# EAGLE design esp32_plus (EAGLE 9.6.2)
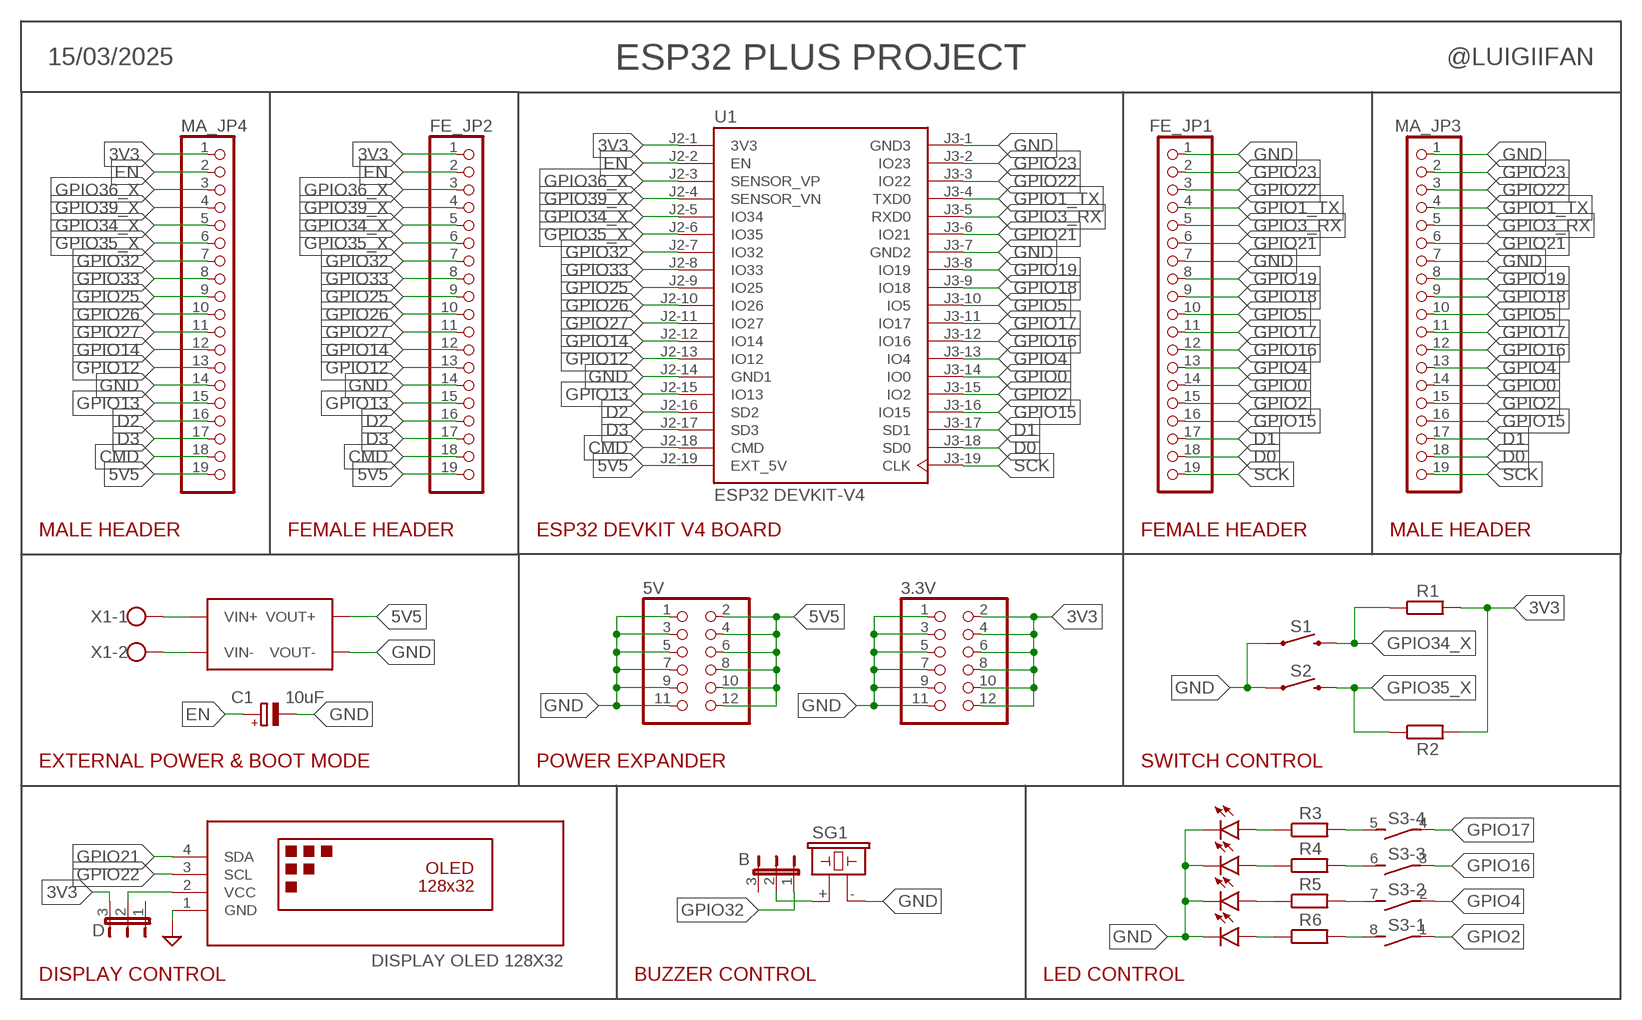
[diagram p0: schematic, sheet 1]

## Parts
3.3V  PINHD-2X6  [2X06]
5V  PINHD-2X6  [2X06]
B  JP2E  [JP2]
C1  10uF  CPOL-EUE2.5-5  [E2,5-5]
D  JP2E  [JP2]
FE_JP1  PINHD-1X19  [1X19]
FE_JP2  PINHD-1X19  [1X19]
L1  LED3MM  [LED3MM]
L2  LED3MM  [LED3MM]
L3  LED3MM  [LED3MM]
L4  LED3MM  [LED3MM]
MA_JP3  PINHD-1X19  [1X19]
MA_JP4  PINHD-1X19  [1X19]
MP1584  MP1584  [DC-BRICK]
R1  R-EU_0207/10  [0207/10]
R2  R-EU_0207/10  [0207/10]
R3  R-EU_0207/10  [0207/10]
R4  R-EU_0207/10  [0207/10]
R5  R-EU_0207/10  [0207/10]
R6  R-EU_0207/10  [0207/10]
S1  MOMENTARY-SWITCH-SPST-PTH-6.0MM  [TACTILE_SWITCH_PTH_6.0MM]
S2  MOMENTARY-SWITCH-SPST-PTH-6.0MM  [TACTILE_SWITCH_PTH_6.0MM]
S3  DS04E  [DS-04]
SG1  F/CM12P  [F/CM12P]
U1  ESP32 DEVKIT-V4  ESP32-DEVKITC-32D  [MODULE_ESP32-DEVKITC-32D]
U$1  DISPLAY OLED 128X32  DISPLAY-OLED-128X32  [DISPLAY-OLED-128X32]
X1  W237-102  [W237-102]

## Nets
3V3: 3.3V.2 3.3V.4 3.3V.6 3.3V.8 3.3V.10 3.3V.12 D.3 FE_JP2.1 MA_JP4.1 R1.2 R2.2 U1.J2-1(3V3)
5V5: 5V.2 5V.4 5V.6 5V.8 5V.10 5V.12 FE_JP2.19 MA_JP4.19 MP1584.OUT1+(VOUT+) MP1584.OUT2+(VOUT+) U1.J2-19(EXT_5V)
CMD: FE_JP2.18 MA_JP4.18 U1.J2-18(CMD)
D0: FE_JP1.18 MA_JP3.18 U1.J3-18(SD0)
D1: FE_JP1.17 MA_JP3.17 U1.J3-17(SD1)
D2: FE_JP2.16 MA_JP4.16 U1.J2-16(SD2)
D3: FE_JP2.17 MA_JP4.17 U1.J2-17(SD3)
EN: C1.+ FE_JP2.2 MA_JP4.2 U1.J2-2(EN)
GND: 3.3V.1 3.3V.3 3.3V.5 3.3V.7 3.3V.9 3.3V.11 5V.1 5V.3 5V.5 5V.7 5V.9 5V.11 C1.- FE_JP1.1 FE_JP1.7 FE_JP2.14 L1.K(C) L2.K(C) L3.K(C) L4.K(C) MA_JP3.1 MA_JP3.7 MA_JP4.14 MP1584.OUT1-(VOUT-) MP1584.OUT2-(VOUT-) S1.1 S2.1 SG1.- U1.J2-14(GND1) U1.J3-1(GND3) U1.J3-7(GND2) U$1.1(GND)
GPIO0: FE_JP1.14 MA_JP3.14 U1.J3-14(IO0)
GPIO1_TX: FE_JP1.4 MA_JP3.4 U1.J3-4(TXD0)
GPIO2: FE_JP1.15 MA_JP3.15 S3.1 U1.J3-15(IO2)
GPIO3_RX: FE_JP1.5 MA_JP3.5 U1.J3-5(RXD0)
GPIO4: FE_JP1.13 MA_JP3.13 S3.2 U1.J3-13(IO4)
GPIO5: FE_JP1.10 MA_JP3.10 U1.J3-10(IO5)
GPIO12: FE_JP2.13 MA_JP4.13 U1.J2-13(IO12)
GPIO13: FE_JP2.15 MA_JP4.15 U1.J2-15(IO13)
GPIO14: FE_JP2.12 MA_JP4.12 U1.J2-12(IO14)
GPIO15: FE_JP1.16 MA_JP3.16 U1.J3-16(IO15)
GPIO16: FE_JP1.12 MA_JP3.12 S3.3 U1.J3-12(IO16)
GPIO17: FE_JP1.11 MA_JP3.11 S3.4 U1.J3-11(IO17)
GPIO18: FE_JP1.9 MA_JP3.9 U1.J3-9(IO18)
GPIO19: FE_JP1.8 MA_JP3.8 U1.J3-8(IO19)
GPIO21: FE_JP1.6 MA_JP3.6 U1.J3-6(IO21) U$1.4(SDA)
GPIO22: FE_JP1.3 MA_JP3.3 U1.J3-3(IO22) U$1.3(SCL)
GPIO23: FE_JP1.2 MA_JP3.2 U1.J3-2(IO23)
GPIO25: FE_JP2.9 MA_JP4.9 U1.J2-9(IO25)
GPIO26: FE_JP2.10 MA_JP4.10 U1.J2-10(IO26)
GPIO27: FE_JP2.11 MA_JP4.11 U1.J2-11(IO27)
GPIO32: B.1 FE_JP2.7 MA_JP4.7 U1.J2-7(IO32)
GPIO33: FE_JP2.8 MA_JP4.8 U1.J2-8(IO33)
GPIO34_X: FE_JP2.5 MA_JP4.5 R1.1 S1.4 U1.J2-5(IO34)
GPIO35_X: FE_JP2.6 MA_JP4.6 R2.1 S2.4 U1.J2-6(IO35)
GPIO36_X: FE_JP2.3 MA_JP4.3 U1.J2-3(SENSOR_VP)
GPIO39_X: FE_JP2.4 MA_JP4.4 U1.J2-4(SENSOR_VN)
N$1: D.2 U$1.2(VCC)
N$2: R4.2 S3.6
N$3: R5.2 S3.7
N$4: R6.2 S3.8
N$5: R3.2 S3.5
N$6: B.2 SG1.+
N$17: L1.A R3.1
N$18: L2.A R4.1
N$19: L3.A R5.1
N$20: L4.A R6.1
N$21: MP1584.IN1+(VIN+) MP1584.IN2+(VIN+) X1.1
N$23: MP1584.IN1-(VIN-) MP1584.IN2-(VIN-) X1.2
SCK: FE_JP1.19 MA_JP3.19 U1.J3-19(CLK)
Unconnected: B.3 D.1

## Notes on the sheet
- ESP32 PLUS PROJECT
- 15/03/2025 | @LUIGIIFAN
- MALE HEADER | FEMALE HEADER | ESP32 DEVKIT V4 BOARD | FEMALE HEADER | MALE HEADER
- EXTERNAL POWER & BOOT MODE | POWER EXPANDER | SWITCH CONTROL
- DISPLAY CONTROL | BUZZER CONTROL | LED CONTROL

## Library data of the parts
3.3V 5V = pinhead_Edit:PINHD-2X6: PIN HEADER
B D = jumper_edit:JP2E: JUMPER
C1 = rcl_Edit:CPOL-EU: POLARIZED CAPACITOR, European symbol; SPICEPREFIX: C
FE_JP1 FE_JP2 MA_JP3 MA_JP4 = pinhead_Edit:PINHD-1X19: PIN HEADER
L1 = led_Edit:LED: LED OSRAM: - CHIPLED LG R971, LG N971, LY N971, LG Q971, LY Q971, LO R971, LY R971 LH N974, LH R974 LS Q976, LO Q976, LY Q976 LO Q996 - Hyper CHIPLED LW Q18S LB Q993, LB Q99A, LB R99A - SideLED LS A670, LO A670, LY A670, LG A670, LP A670 LB A673, LV A673, LT A673, LW A673 LH A674 LY A675 LS A676, LA A676, LO A676, LY A676, LW A676 LS A679, LY A679, LG A679 - Hyper Micro SIDELED® LS Y876, LA Y876, LO Y876, LY Y876 LT Y87S - SmartLED LW L88C, LW L88S LB L89C, LB L89S, LG L890 LS L89K, LO L89K, LY L89K LS L896, LA L896, LO L896, LY L896 - TOPLED LS T670, LO T670, LY T670, LG T670, LP T670 LSG T670, LSP T670, LSY T670, LOP T670, LYG T670 LG T671, LOG T671, LSG T671 LB T673, LV T673, LT T673, LW T673 LH T674 LS T676, LA T676, LO T676, LY T676, LB T676, LH T676, LSB T676, LW T676 LB T67C, LV T67C, LT T67C, LS T67K, LO T67K, LY T67K, LW E67C LS E67B, LA E67B, LO E67B, LY E67B, LB E67C, LV E67C, LT E67C LW T67C LS T679, LY T679, LG T679 LS T770, LO T770, LY T770, LG T770, LP T770 LB T773, LV T773, LT T773, LW T773 LH T774 LS E675, LA E675, LY E675, LS T675 LS T776, LA T776, LO T776, LY T776, LB T776 LHGB T686 LT T68C, LB T68C - Hyper Mini TOPLED® LB M676 - Mini TOPLED Santana® LG M470 LS M47K, LO M47K, LY M47K Source: http://www.osram.convergy.de LUXEON: - LUMILED® LXK2-PW12-R00, LXK2-PW12-S00, LXK2-PW14-U00, LXK2-PW14-V00 LXK2-PM12-R00, LXK2-PM12-S00, LXK2-PM14-U00 LXK2-PE12-Q00, LXK2-PE12-R00, LXK2-PE12-S00, LXK2-PE14-T00, LXK2-PE14-U00 LXK2-PB12-K00, LXK2-PB12-L00, LXK2-PB12-M00, LXK2-PB14-N00, LXK2-PB14-P00, LXK2-PB14-Q00 LXK2-PR12-L00, LXK2-PR12-M00, LXK2-PR14-Q00, LXK2-PR14-R00 LXK2-PD12-Q00, LXK2-PD12-R00, LXK2-PD12-S00 LXK2-PH12-R00, LXK2-PH12-S00 LXK2-PL12-P00, LXK2-PL12-Q00, LXK2-PL12-R00 Source: www.luxeon.com KINGBRIGHT: KA-3528ASYC Source: www.kingbright.com; SPICEPREFIX: L
L2-L4 = led_Edit:LED: LED OSRAM: - CHIPLED LG R971, LG N971, LY N971, LG Q971, LY Q971, LO R971, LY R971 LH N974, LH R974 LS Q976, LO Q976, LY Q976 LO Q996 - Hyper CHIPLED LW Q18S LB Q993, LB Q99A, LB R99A - SideLED LS A670, LO A670, LY A670, LG A670, LP A670 LB A673, LV A673, LT A673, LW A673 LH A674 LY A675 LS A676, LA A676, LO A676, LY A676, LW A676 LS A679, LY A679, LG A679 - Hyper Micro SIDELED® LS Y876, LA Y876, LO Y876, LY Y876 LT Y87S - SmartLED LW L88C, LW L88S LB L89C, LB L89S, LG L890 LS L89K, LO L89K, LY L89K LS L896, LA L896, LO L896, LY L896 - TOPLED LS T670, LO T670, LY T670, LG T670, LP T670 LSG T670, LSP T670, LSY T670, LOP T670, LYG T670 LG T671, LOG T671, LSG T671 LB T673, LV T673, LT T673, LW T673 LH T674 LS T676, LA T676, LO T676, LY T676, LB T676, LH T676, LSB T676, LW T676 LB T67C, LV T67C, LT T67C, LS T67K, LO T67K, LY T67K, LW E67C LS E67B, LA E67B, LO E67B, LY E67B, LB E67C, LV E67C, LT E67C LW T67C LS T679, LY T679, LG T679 LS T770, LO T770, LY T770, LG T770, LP T770 LB T773, LV T773, LT T773, LW T773 LH T774 LS E675, LA E675, LY E675, LS T675 LS T776, LA T776, LO T776, LY T776, LB T776 LHGB T686 LT T68C, LB T68C - Hyper Mini TOPLED® LB M676 - Mini TOPLED Santana® LG M470 LS M47K, LO M47K, LY M47K Source: http://www.osram.convergy.de LUXEON: - LUMILED® LXK2-PW12-R00, LXK2-PW12-S00, LXK2-PW14-U00, LXK2-PW14-V00 LXK2-PM12-R00, LXK2-PM12-S00, LXK2-PM14-U00 LXK2-PE12-Q00, LXK2-PE12-R00, LXK2-PE12-S00, LXK2-PE14-T00, LXK2-PE14-U00 LXK2-PB12-K00, LXK2-PB12-L00, LXK2-PB12-M00, LXK2-PB14-N00, LXK2-PB14-P00, LXK2-PB14-Q00 LXK2-PR12-L00, LXK2-PR12-M00, LXK2-PR14-Q00, LXK2-PR14-R00 LXK2-PD12-Q00, LXK2-PD12-R00, LXK2-PD12-S00 LXK2-PH12-R00, LXK2-PH12-S00 LXK2-PL12-P00, LXK2-PL12-Q00, LXK2-PL12-R00 Source: www.luxeon.com KINGBRIGHT: KA-3528ASYC Source: www.kingbright.com
MP1584 = MP1584:MP1584: MP1584-dc-brick-pcb Step down Input: 4.5V - 28V Ouput 0.8V - 25V max. 3A Cheap on ebay
R1-R6 = rcl_Edit:R-EU_: RESISTOR, European symbol; SPICEPREFIX: R
S1 S2 = Sparkfun-SwitchEdit:MOMENTARY-SWITCH-SPST: Momentary Switch (Pushbutton) - SPST Normally-open (NO) SPST momentary switches (buttons, pushbuttons). Variants PTH-12MM - 12mm square, through-hole Momentary Pushbutton Switch - 12mm Square <https://www.sparkfun.com/products/9190> (COM-09190) PTH-6.0MM, PTH-6.0MM-KIT - 6.0mm square, through-hole Mini Pushbutton Switch <https://www.sparkfun.com/products/97> (COM-00097) KIT package intended for soldering kit's - only one side of pads' copper is exposed. PTH-RIGHT-ANGLE-KIT - Right-angle, through-hole Right Angle Tactile Button <https://www.sparkfun.com/products/10791> - Used on SparkFun BigTime Watch Kit <https://www.sparkfun.com/products/11734> SMD-12MM - 12mm square, surface-mount Tactile Button - SMD (12mm) <https://www.sparkfun.com/products/12993> (COM-12993) Used on SparkFun PicoBoard <https://www.sparkfun.com/products/11888> SMD-4.5MM - 4.5mm Square Trackball Switch Used on SparkFun Blackberry Trackballer Breakout <https://www.sparkfun.com/products/13169> SMD-4.6MMX2.8MM - 4.60mm x 2.80mm, surface mount Used on SparkFun SAMD21 Mini Breakout <https://www.sparkfun.com/products/13664> SMD-5.2MM, SMD-5.2-REDUNDANT - 5.2mm square, surface-mount Mini Pushbutton Switch - SMD <https://www.sparkfun.com/products/8720> (COM-08720) Used on Arduino Pro Mini <https://www.sparkfun.com/products/11114> REDUNDANT package connects both switch circuits together SMD-6.0X3.5MM - 6.0 x 3.5mm, surface mount Momentary Reset Switch SMD <https://www.sparkfun.com/products/8229> (COM-08229) SMD-6.2MM-TALL - 6.2mm square, surface mount Tactile Button - SMD (6mm) <https://www.sparkfun.com/products/12992> Used on SparkFun Digital Sandbox <https://www.sparkfun.com/products/12651> SMD-RIGHT-ANGLE - Right-angle, surface mount Used on SparkFun Block for Intel® Edison - Arduino <https://www.sparkfun.com/products/13036>; PROD_ID: SWCH-08441; SF_SKU: COM-00097
S3 = switch-dil:DS04E: DIL/CODE SWITCH; OC_FARNELL: unknown; OC_NEWARK: unknown
SG1 = buzzer:F/CM12P: BUZZER Source: Buerklin; OC_FARNELL: unknown; OC_NEWARK: unknown
U1 = ESP32-DEVKITC-32D:ESP32-DEVKITC-32D: Check availability <https://pricing.snapeda.com/parts/ESP32-DEVKITC-32D/Espressif%20Systems/view-part?ref=eda>; AVAILABILITY: In Stock; CHECK_PRICES: https://www.snapeda.com/parts/ESP32-DEVKITC-32D/Espressif+Systems/view-part/?ref=eda; DESCRIPTION: WiFi Development Tools (802.11) ESP32 General Development Kit, ESP32-WROOM-32D on the board; MF: Espressif Systems; MP: ESP32-DEVKITC-32D; PACKAGE: None; PRICE: None; SNAPEDA_LINK: https://www.snapeda.com/parts/ESP32-DEVKITC-32D/Espressif+Systems/view-part/?ref=snap
U$1 = diy-modules_new:DISPLAY-OLED-128X32: 128x32 Dot Matrix OLED Module with I2C interface based on SSD1306 chip More details available here: http://www.tinyosshop.com/index.php?route=product/product&product_id=953 Schematic available here: http://www.tinyosshop.com/datasheet/OLED%2012832.pdf SSD1306 datasheet: https://cdn-shop.adafruit.com/datasheets/SSD1306.pdf Click here to find device on ebay.com <http://www.ebay.com/sch/oled+display+128x32+i2c>
X1 = con-wago-500:W237-102: WAGO SCREW CLAMP; MPN: 237-102; OC_FARNELL: unknown; OC_NEWARK: 70K9898

## Board
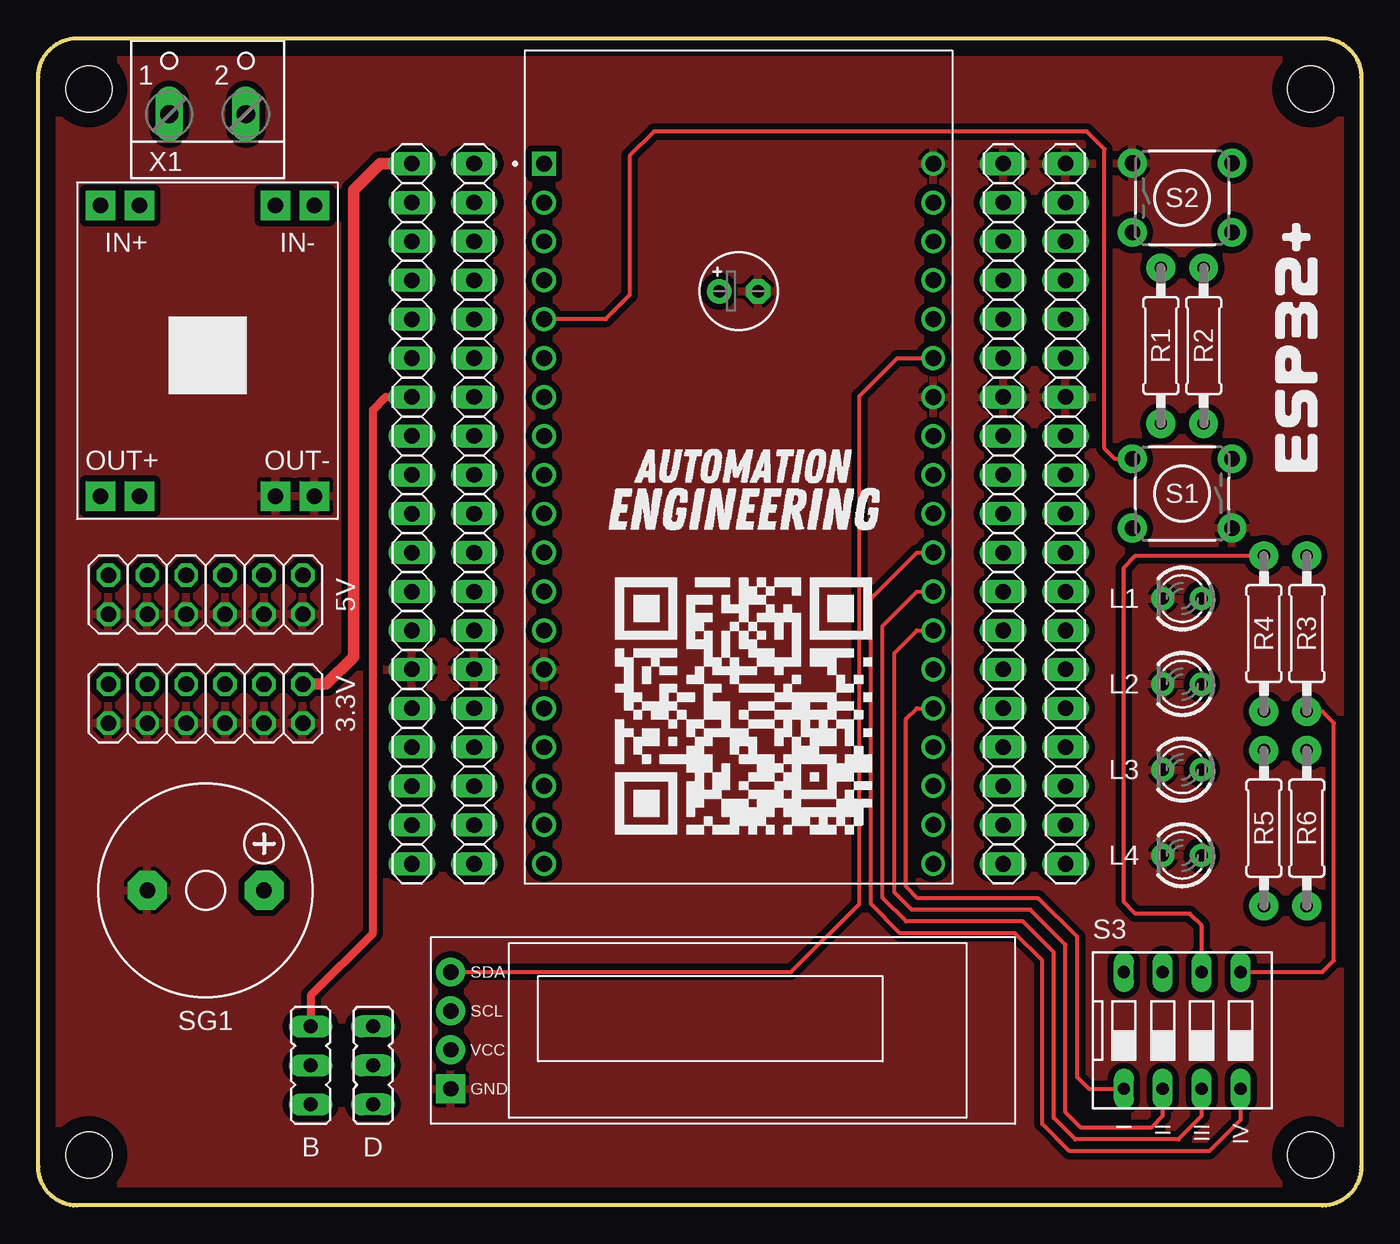
[diagram p1: board, top side]
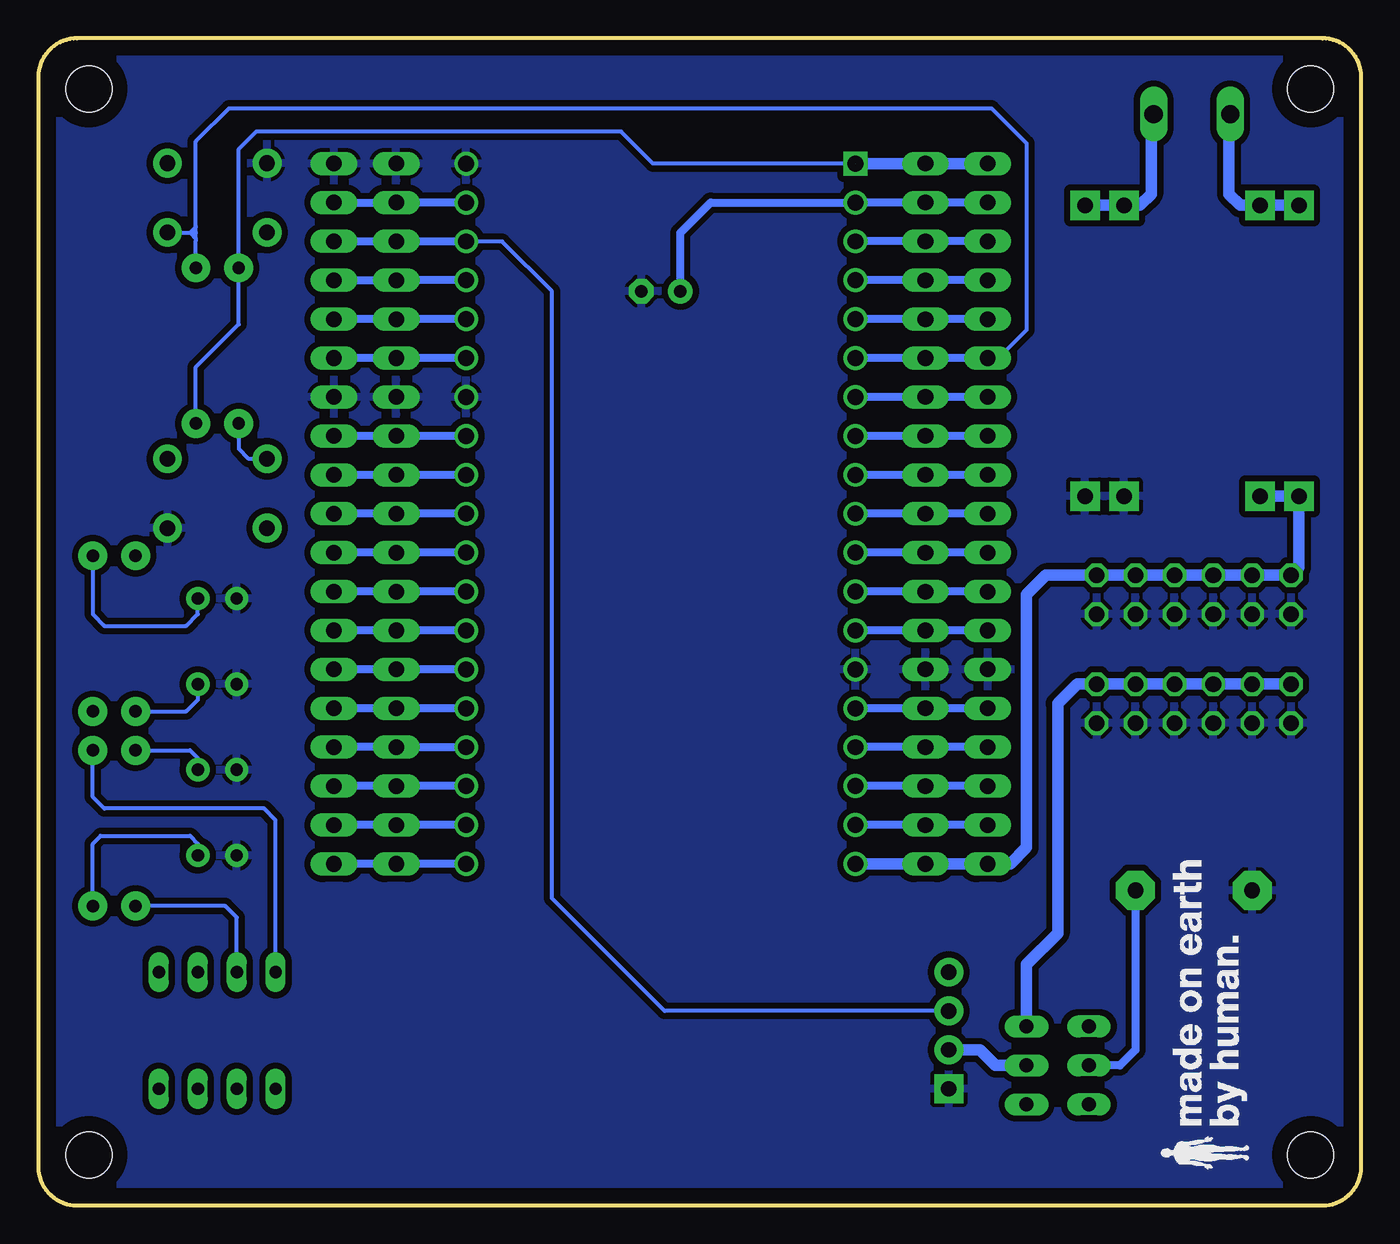
[diagram p2: board, bottom side, seen from below]

Size 86.36 x 76.2 mm. Coordinates in mm from the lower left corner, seen from the top.
Outline: 86.36,73.66 86.36,2.54 arc-90 83.82,0 2.54,0 arc-90 0,2.54 0,73.66 arc-90 2.54,76.2 83.82,76.2 arc-90 86.36,73.66
Copper layers (1*16): Top 0.035mm / dielectric 1.5mm / Bottom 0.035mm
Design rules "default": minimum track width 6mil, minimum drill 0.35mm, track to track 6mil, track to pad 6mil, pad to pad 6mil, via to via 6mil, smd to smd 6mil, copper to edge 40mil, drill to drill 6mil, minimum pad ring 10mil, minimum via ring 8mil, stop-mask expansion 4mil, vias tented up to drill 0mil, thermal gap 10mil
Holes 3 mm at 3.3,3.3 83.06,3.3 83.06,72.9 3.3,72.9

### Footprints (pad centres in the part's own frame; a part is rotated, then mirrored left to right if it is on the bottom)
2X06 = drill 1.016 octagon: 1 -6.35,-1.27; 2 -6.35,1.27; 3 -3.81,-1.27; 4 -3.81,1.27; 5 -1.27,-1.27; 6 -1.27,1.27; 7 1.27,-1.27; 8 1.27,1.27; 9 3.81,-1.27; 10 3.81,1.27; 11 6.35,-1.27; 12 6.35,1.27
JP2 = drill 0.914 long: 1 -2.54,0; 2 0,0; 3 2.54,0
E2,5-5 = drill 0.813 pad 1.6: + -1.27,0 | drill 0.813 pad 1.6 octagon: - 1.27,0
1X19 = drill 1.016 long: 1 -22.86,0; 2 -20.32,0; 3 -17.78,0; 4 -15.24,0; 5 -12.7,0; 6 -10.16,0; 7 -7.62,0; 8 -5.08,0; 9 -2.54,0; 10 0,0; 11 2.54,0; 12 5.08,0; 13 7.62,0; 14 10.16,0; 15 12.7,0; 16 15.24,0; 17 17.78,0; 18 20.32,0; 19 22.86,0
LED3MM = drill 0.8 pad 1.524: A -1.27,0; K 1.27,0
DC-BRICK = drill 1.016 pad 1.93 square: IN1+ 1.5,1.527; IN1- 1.5,12.946; IN2+ 1.5,4.07; IN2- 1.5,15.489; OUT1+ 20.5,1.527; OUT1- 20.5,12.946; OUT2+ 20.5,4.07; OUT2- 20.5,15.489
0207/10 = drill 0.813 pad 1.88: 1 -5.08,0; 2 5.08,0
TACTILE_SWITCH_PTH_6.0MM = drill 1.016 pad 1.88: 1 -3.251,2.261; 2 3.251,2.261; 3 -3.251,-2.261; 4 3.251,-2.261
DS-04 = drill 0.813 long: 1 -3.81,-3.81; 2 -1.27,-3.81; 3 1.27,-3.81; 4 3.81,-3.81; 5 3.81,3.81; 6 1.27,3.81; 7 -1.27,3.81; 8 -3.81,3.81
F/CM12P = drill 1.016 pad 2.54 octagon: + 3.81,0; - -3.81,0
MODULE_ESP32-DEVKITC-32D = drill 1.04 square: J2-1 -12.7,19.76 | drill 1.04: J2-2 -12.7,17.22; J2-3 -12.7,14.68; J2-4 -12.7,12.14; J2-5 -12.7,9.6; J2-6 -12.7,7.06; J2-7 -12.7,4.52; J2-8 -12.7,1.98; J2-9 -12.7,-0.56; J2-10 -12.7,-3.1; J2-11 -12.7,-5.64; J2-12 -12.7,-8.18; J2-13 -12.7,-10.72; J2-14 -12.7,-13.26; J2-15 -12.7,-15.8; J2-16 -12.7,-18.34; J2-17 -12.7,-20.88; J2-18 -12.7,-23.42; J2-19 -12.7,-25.96; J3-1 12.7,19.76; J3-2 12.7,17.22; J3-3 12.7,14.68; J3-4 12.7,12.14; J3-5 12.7,9.6; J3-6 12.7,7.06; J3-7 12.7,4.52; J3-8 12.7,1.98; J3-9 12.7,-0.56; J3-10 12.7,-3.1; J3-11 12.7,-5.64; J3-12 12.7,-8.18; J3-13 12.7,-10.72; J3-14 12.7,-13.26; J3-15 12.7,-15.8; J3-16 12.7,-18.34; J3-17 12.7,-20.88; J3-18 12.7,-23.42; J3-19 12.7,-25.96
DISPLAY-OLED-128X32 = drill 1 pad 1.88 square: 1 -17.78,-3.81 | drill 1 pad 1.88: 2 -17.78,-1.27; 3 -17.78,1.27; 4 -17.78,3.81
W237-102 = drill 1.194 long: 1 -2.5,-1.27; 2 2.5,-1.27

### Placement (x,y rotation side)
3.3V  10.92,32.77 0 top
5V  10.92,39.88 0 top
B  17.78,9.14 270 top
C1  45.72,59.69 0 top
D  21.84,9.14 90 top
FE_JP1  62.99,45.16 270 top
FE_JP2  28.45,45.16 270 top
L1  74.68,39.62 180 top
L2  74.68,34.04 180 top
L3  74.68,28.45 180 top
L4  74.68,22.86 180 top
MA_JP3  67.06,45.16 270 top
MA_JP4  24.38,45.16 270 top
MP1584  2.54,66.8 270 top
R1  73.28,56.13 90 top
R2  76.07,56.13 270 top
R3  82.8,37.34 270 top
R4  80.01,37.34 90 top
R5  80.01,24.64 270 top
R6  82.8,24.64 90 top
S1  74.68,46.48 180 top
S2  74.68,65.79 0 top
S3  74.68,11.43 0 top
SG1  10.92,20.57 0 top
U1  45.72,48.26 0 top
U$1  44.7,11.43 0 top
X1  11.05,72.52 0 top

### Tracks (layer width: path | path; a pad name or v marks a point on that pad's centre or on a via)
3V3  (1 unrouted)
  Top 0.762: 3.3V.12 18.8,34.04 20.57,35.81 20.57,66.29 22.3,68.02 MA_JP4.1
  Bottom 0.254: R2.2 76.07,54.74 73.28,57.53 R1.2 73.28,68.96 72.14,70.1 48.31,70.1 46.23,68.02 U1.J2-1
  Bottom 0.762: MA_JP4.1 FE_JP2.1 U1.J2-1 | 3.3V.2 3.3V.4 3.3V.6 3.3V.8 3.3V.10 3.3V.12 18.54,34.04 19.81,32.77 19.81,17.78 21.84,15.75 D.3
5V5
  Bottom 0.762: U1.J2-19 FE_JP2.19 MA_JP4.19 22.91,22.3 21.84,23.37 21.84,39.88 20.57,41.15 5V.12 5V.10 5V.8 5V.6 5V.4 5V.2 4.07,41.65 MP1584.OUT1+ MP1584.OUT2+
CMD
  Bottom 0.508: U1.J2-18 FE_JP2.18 MA_JP4.18
D0
  Bottom 0.508: U1.J3-18 FE_JP1.18 MA_JP3.18
D1
  Bottom 0.508: U1.J3-17 FE_JP1.17 MA_JP3.17
D2
  Bottom 0.508: U1.J2-16 FE_JP2.16 MA_JP4.16
D3
  Bottom 0.508: U1.J2-17 FE_JP2.17 MA_JP4.17
EN
  Bottom 0.508: U1.J2-2 FE_JP2.2 MA_JP4.2 | U1.J2-2 | C1.+ 44.45,63.5 42.47,65.48 U1.J2-2
GND
  pour Bottom (isolate 0.406): 86.36,73.66 86.36,2.54 arc-90 83.82,0 2.54,0 arc-90 0,2.54 0,73.66 arc-90 2.54,76.2 83.82,76.2 arc-90
  pour Top (isolate 0.406): 0,73.66 0,2.54 arc90 2.54,0 83.82,0 arc90 86.36,2.54 86.36,73.66 arc90 83.82,76.2 2.54,76.2 arc90
GPIO0
  Bottom 0.508: U1.J3-14 FE_JP1.14 MA_JP3.14
GPIO1_TX
  Bottom 0.508: U1.J3-4 FE_JP1.4 MA_JP3.4
GPIO2
  Top 0.254: U1.J3-15 57.35,32.46 56.64,31.75 56.64,20.83 57.4,20.07 65.28,20.07 67.82,17.53 67.82,8.38 68.58,7.62 S3.1
  Bottom 0.508: U1.J3-15 FE_JP1.15 MA_JP3.15
GPIO3_RX
  Bottom 0.508: U1.J3-5 FE_JP1.5 MA_JP3.5
GPIO4
  Top 0.254: U1.J3-13 57.35,37.54 55.88,36.07 55.88,20.45 57.02,19.3 64.77,19.3 67.06,17.02 67.06,6.1 68.07,5.08 72.64,5.08 73.41,5.84 S3.2
  Bottom 0.508: U1.J3-13 FE_JP1.13 MA_JP3.13
GPIO5
  Bottom 0.508: U1.J3-10 FE_JP1.10 MA_JP3.10
GPIO12
  Bottom 0.508: U1.J2-13 FE_JP2.13 MA_JP4.13
GPIO13
  Bottom 0.508: U1.J2-15 FE_JP2.15 MA_JP4.15
GPIO14
  Bottom 0.508: U1.J2-12 FE_JP2.12 MA_JP4.12
GPIO15
  Bottom 0.508: U1.J3-16 FE_JP1.16 MA_JP3.16
GPIO16
  Top 0.254: U1.J3-12 57.35,40.08 55.12,37.85 55.12,20.09 56.67,18.54 64.26,18.54 66.29,16.51 66.29,5.71 67.69,4.32 74.42,4.32 75.95,5.84 S3.3
  Bottom 0.508: U1.J3-12 FE_JP1.12 MA_JP3.12
GPIO17
  Top 0.254: U1.J3-11 57.35,42.62 54.36,39.62 54.36,19.68 56.26,17.78 63.75,17.78 65.53,16 65.53,5.33 67.31,3.56 76.45,3.56 78.49,5.59 S3.4
  Bottom 0.508: U1.J3-11 FE_JP1.11 MA_JP3.11
GPIO18
  Bottom 0.508: U1.J3-9 FE_JP1.9 MA_JP3.9
GPIO19
  Bottom 0.508: U1.J3-8 FE_JP1.8 MA_JP3.8
GPIO21
  Top 0.254: U$1.4 49.15,15.24 53.59,19.68 53.59,52.83 56.08,55.32 U1.J3-6
  Bottom 0.508: U1.J3-6 FE_JP1.6 MA_JP3.6
GPIO22
  Bottom 0.254: U1.J3-3 56.08,62.94 52.83,59.69 52.83,20.07 45.47,12.7 U$1.3
  Bottom 0.508: U1.J3-3 FE_JP1.3 MA_JP3.3
GPIO23
  Bottom 0.508: U1.J3-2 FE_JP1.2 MA_JP3.2
GPIO25
  Bottom 0.508: U1.J2-9 FE_JP2.9 MA_JP4.9
GPIO26
  Bottom 0.508: U1.J2-10 FE_JP2.10 MA_JP4.10
GPIO27
  Bottom 0.508: U1.J2-11 FE_JP2.11 MA_JP4.11
GPIO32
  Top 0.508: MA_JP4.7 22.68,52.78 21.84,51.94 21.84,17.78 17.78,13.72 B.1
  Bottom 0.508: U1.J2-7 FE_JP2.7 MA_JP4.7
GPIO33
  Bottom 0.508: U1.J2-8 FE_JP2.8 MA_JP4.8
GPIO34_X
  Top 0.254: S1.4 70.28,48.74 69.6,49.43 69.6,68.96 68.45,70.1 40.18,70.1 38.61,68.53 38.61,59.44 37.03,57.86 U1.J2-5
  Bottom 0.254: S1.4 72.62,48.74 73.28,49.4 R1.1
  Bottom 0.508: U1.J2-5 FE_JP2.5 MA_JP4.5
GPIO35_X
  Bottom 0.254: MA_JP4.6 23.67,55.32 21.84,57.15 21.84,69.34 24.13,71.63 73.91,71.63 76.07,69.47 76.07,63.88 | S2.4 77.9,63.5 76.45,63.5 | R2.1 76.07,62.99 76.07,63.12 | 76.07,63.12 76.07,63.5 | 76.07,63.5 76.07,63.88 | 76.45,63.5 76.07,63.5 | 76.45,63.5 76.07,63.88 | 76.45,63.5 76.07,63.12
  Bottom 0.508: U1.J2-6 FE_JP2.6 MA_JP4.6
GPIO36_X
  Bottom 0.508: U1.J2-3 FE_JP2.3 MA_JP4.3
GPIO39_X
  Bottom 0.508: U1.J2-4 FE_JP2.4 MA_JP4.4
N$1
  Bottom 0.762: U$1.2 24.89,10.16 23.88,9.14 D.2
N$2
  Top 0.254: S3.6 75.95,18.29 75.18,19.05 71.63,19.05 70.87,19.81 70.87,41.66 71.63,42.42 R4.2
N$3
  Bottom 0.254: S3.7 73.41,18.8 74.17,19.56 R5.2
N$4
  Bottom 0.254: S3.8 70.87,25.15 71.63,25.91 82.04,25.91 82.8,26.67 R6.2
N$5
  Top 0.254: S3.5 83.82,15.24 84.58,16 84.58,31.5 83.82,32.26 R3.2
N$6
  Bottom 0.508: SG1.+ 14.73,10.16 15.75,9.14 B.2
N$17
  Bottom 0.254: R3.1 82.8,38.61 82.04,37.85 76.71,37.85 75.95,38.61 L1.A
N$18
  Bottom 0.254: L2.A 75.95,33.02 76.71,32.26 R4.1
N$19
  Bottom 0.254: R5.1 76.45,29.72 75.95,29.21 L3.A
N$20
  Bottom 0.254: R6.1 82.8,23.62 82.3,24.13 76.45,24.13 75.95,23.62 L4.A
N$21
  Bottom 0.762: X1.1 8.64,71.16 8.64,66.04 7.9,65.3 MP1584.IN2+ MP1584.IN1+
N$23
  Bottom 0.762: X1.2 13.72,71.08 13.72,66.04 14.45,65.3 MP1584.IN1- MP1584.IN2-
SCK
  Bottom 0.508: U1.J3-19 FE_JP1.19 MA_JP3.19

### Text on the board
tPlace: I | II | III | IV
tNames: ⏚ | ⏚